# EAGLE design Mayfly_v0p5b (EAGLE 7.5.0)
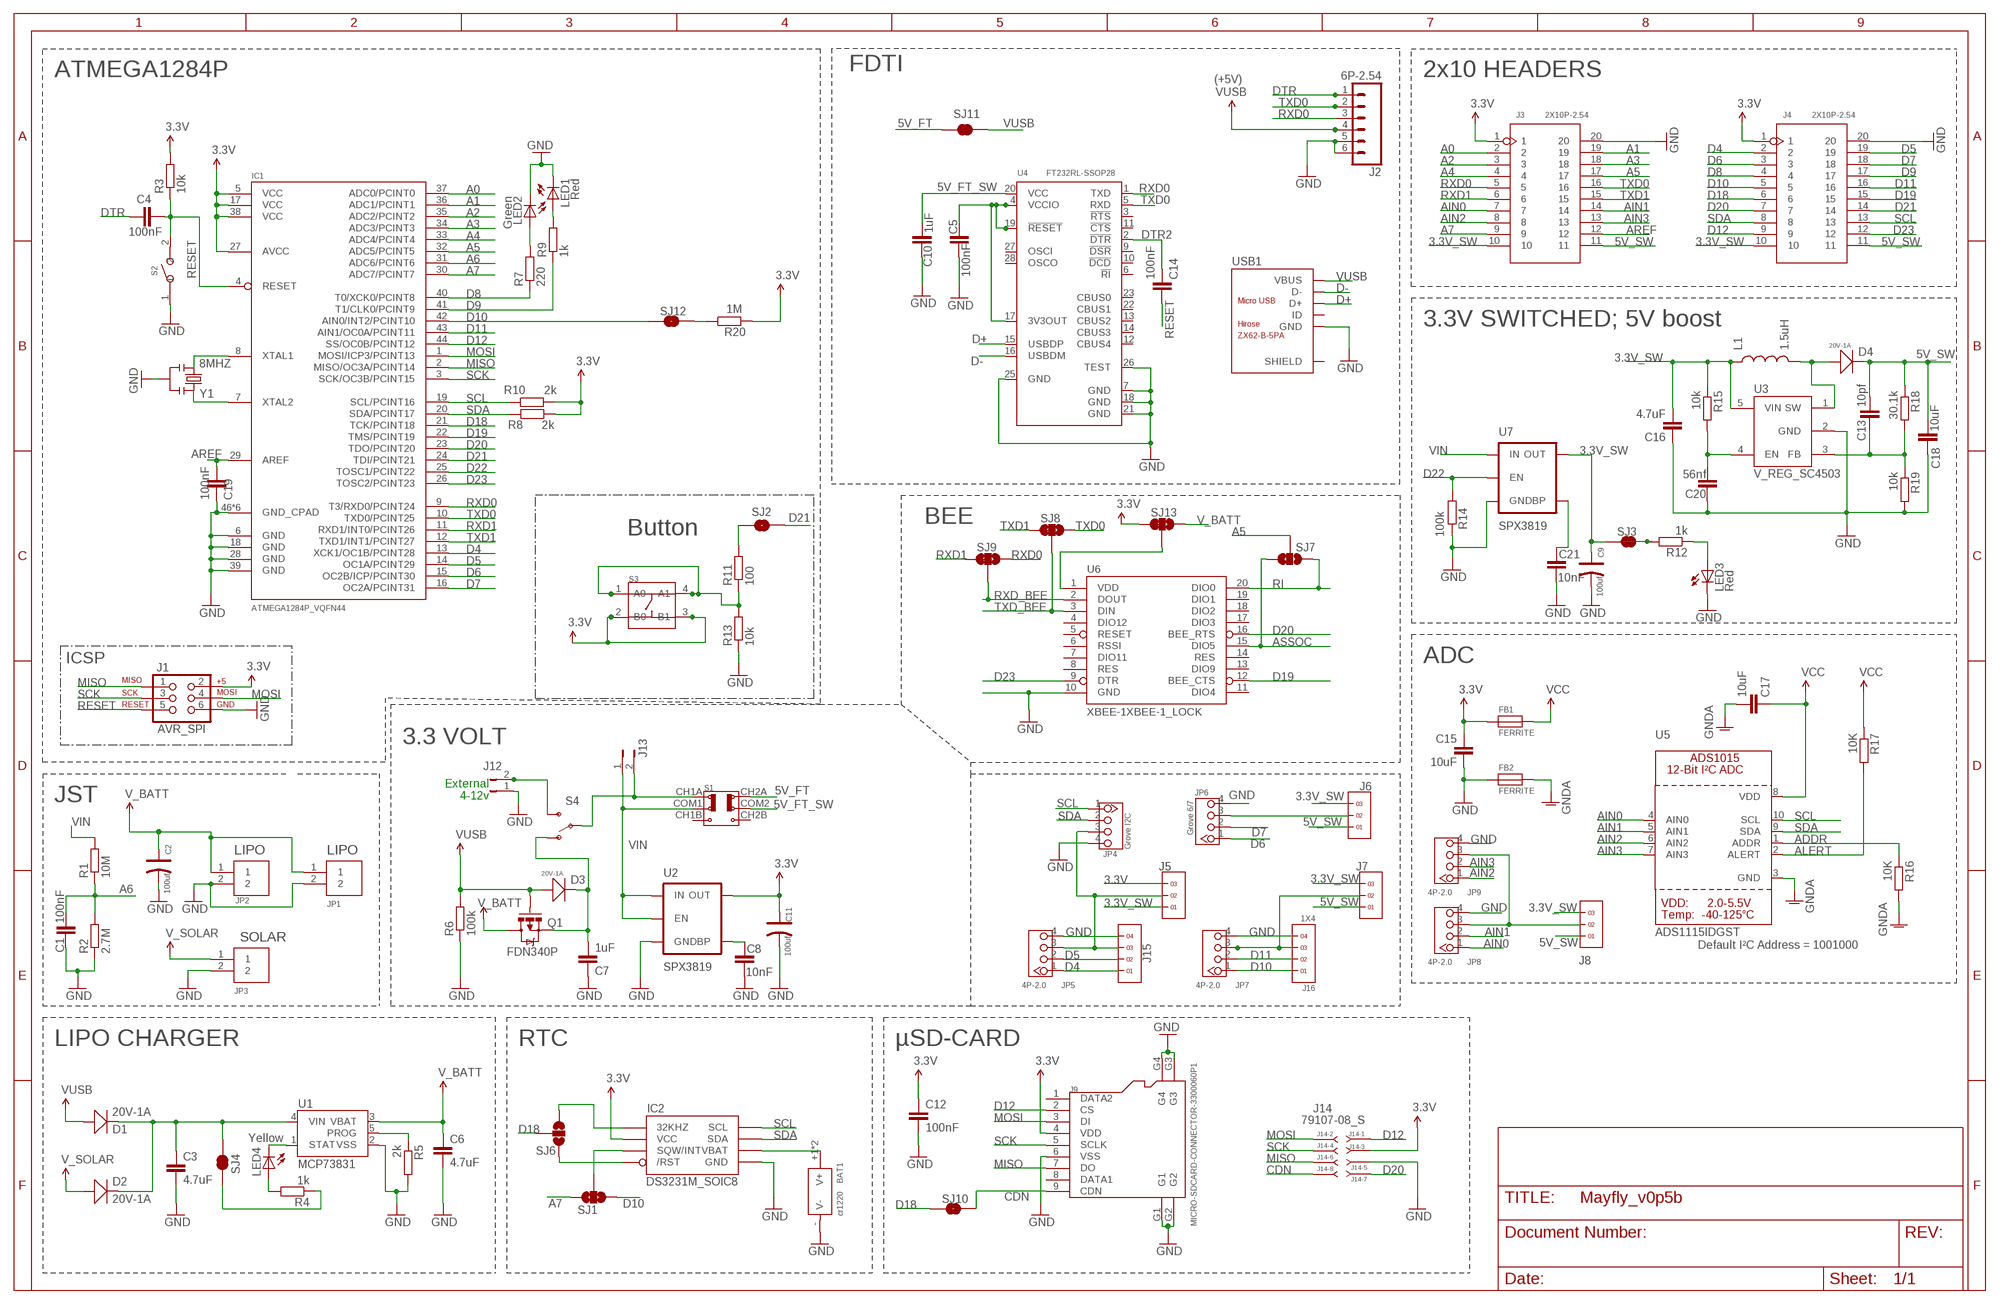
[diagram p0: schematic, sheet 1]

## Parts
BAT1  cr1220  DIP-BATTERY-CELL-HOLDER(1220)  [BAT2P-13.5-CR1220]
C1  100nF  C_0603  [C0603]
C2  100uf  TANTALUM-SMD-100UF-10V(AVX-B)  [AVX-B]
C3  4.7uF  C_0603  [C0603]
C4  100nF  C_0603  [C0603]
C5  100nF  C_0603  [C0603]
C6  4.7uF  C_0603  [C0603]
C7  1uF  C_0603  [C0603]
C8  10nF  C_0603  [C0603]
C9  100uf  TANTALUM-SMD-100UF-10V(AVX-B)  [AVX-B]
C10  1uF  C_0603  [C0603]
C11  100uf  TANTALUM-SMD-100UF-10V(AVX-B)  [AVX-B]
C12  100nF  C_0603  [C0603]
C13  10pf  CAP0603-CAP  [0603-CAP]
C14  100nF  C_0603  [C0603]
C15  10uF  C_0603  [C0603]
C16  4.7uF  CAP0805  [0805]
C17  10uF  C_0603  [C0603]
C18  10uF  CAP0805  [0805]
C19  100nF  C_0603  [C0603]
C20  56nf  CAP0603-CAP  [0603-CAP]
C21  10nF  C_0603  [C0603]
D1  20V-1A  SMD-DIODE-SCHOTTKY-20V-1A(SOD-123)  [SOD-123]
D2  20V-1A  SMD-DIODE-SCHOTTKY-20V-1A(SOD-123)  [SOD-123]
D3  20V-1A  SMD-DIODE-SCHOTTKY-20V-1A(SOD-123)  [SOD-123]
D4  20V-1A  SMD-DIODE-SCHOTTKY-20V-1A(SOD-123)  [SOD-123]
FB1  FERRITE  FERRITE0805  [0805]
FB2  FERRITE  FERRITE0805  [0805]
IC1  ATMEGA1284P_VQFN44  [VQFN44]
IC2  DS3231M_SOIC8  [SO8]
J1  AVR_SPI  AVR_SPI_PRG_6NS  [2X3-NS]
J2  6P-2.54  M06FEMALE_LOCK  [1X06_FEMALE_LOCK.010]
J3  2X10P-2.54  DIP-BLACK-FEMALE-HEADER(2X10P-2.54)-2.54  [H2X10-2.54]
J4  2X10P-2.54  DIP-BLACK-FEMALE-HEADER(2X10P-2.54)-2.54  [H2X10-2.54]
J5  1X3  [1X3]
J6  1X3  [1X3]
J7  1X3  [1X3]
J8  1X3  [1X3]
J9  MICRO-SDCARD-CONNECTOR-3300060P1  [9P-SMD-W-RING]
J12  JUMPER-PTH-2-NO  [PTH-JUMPER-2-NO_NO_SILK]
J13  JUMPER-PTH-2-NO  [PTH-JUMPER-2-NO_NO_SILK]
J14  79107-08_S  [79107-08]
J15  1X4  [1X4]
J16  1X4  [1X4]
JP1  JST_EPH_2PIN  [JST_EPH_B2B-PH-K-S]
JP2  JST_EPH_2PIN  [JST_EPH_B2B-PH-K-S]
JP3  JST_EPH_2PIN  [JST_EPH_B2B-PH-K-S]
JP4  Grove I2C  GROVE-CONNECTOR-DIP(4P-2.0)  [HW4-2.0]
JP5  4P-2.0  GROVE-CONNECTOR-DIP(4P-2.0)  [HW4-2.0]
JP6  Grove 6/7  GROVE-CONNECTOR-DIP(4P-2.0)  [HW4-2.0]
JP7  4P-2.0  GROVE-CONNECTOR-DIP(4P-2.0)  [HW4-2.0]
JP8  4P-2.0  GROVE-CONNECTOR-DIP(4P-2.0)  [HW4-2.0]
JP9  4P-2.0  GROVE-CONNECTOR-DIP(4P-2.0)  [HW4-2.0]
L1  1.5uH  INDUCTORVLF4012A  [VLF4012A]
LED1  Red  LED0603  [LED-0603]
LED2  Green  LED0603  [LED-0603]
LED3  Red  LED0603  [LED-0603]
LED4  Yellow  LED0603  [LED-0603]
Q1  FDN340P  MOSFET-P-CHANNELSMALL  [SOT23-S-PADS]
R1  10M  R_0603  [R0603]
R2  2.7M  R_0603  [R0603]
R3  10k  R_0603  [R0603]
R4  1k  R_0603  [R0603]
R5  2k  R_0603  [R0603]
R6  100k  R_0603  [R0603]
R7  220  R_0603  [R0603]
R8  2k  R_0603  [R0603]
R9  1k  R_0603  [R0603]
R10  2k  R_0603  [R0603]
R11  100  R_0603  [R0603]
R12  1k  R_0603  [R0603]
R13  10k  R_0603  [R0603]
R14  100k  R_0603  [R0603]
R15  10k  R_0603  [R0603]
R16  10K  R_0603  [R0603]
R17  10K  R_0603  [R0603]
R18  30.1k  R_0603  [R0603]
R19  10k  R_0603  [R0603]
R20  1M  R_0603  [R0603]
S1  SWITCH-2CH-6P-3010010P1  [6P-2CH-2.54-9.1X3.5X3.2+2H]
S2  SMD-BUTTON(2P-6.0X3.0X2.5MM)-DHT-1163S  [SW2-4.0-6.0X3.0X2.5MM]
S3  SMD-SWITCH-TACTILE-SPST-NO(4P-D6.0MM)  [SW4-SMD-6.0X6.0X5.0MM]
S4  SWITCH-SPDT-SMD-A  [SWITCH-SPST-SMD-A]
SJ1  SOLDERJUMPER_2WAYT  [SJ_2]
SJ2  SOLDERJUMPERNO  [SJ_2S-NO]
SJ3  SOLDERJUMPERNO  [SJ_2S-NO]
SJ4  SOLDERJUMPER_NC  [SJ_2S_NC]
SJ6  SOLDERJUMPER_2WAYT  [SJ_2]
SJ7  SOLDERJUMPER_2WAYT  [SJ_2]
SJ8  SJ_3WAY_12SHORT  [SJ_3WAY_12SHORT]
SJ9  SJ_3WAY_12SHORT  [SJ_3WAY_12SHORT]
SJ10  SOLDERJUMPERNO  [SJ_2S-NO]
SJ11  JUMPER-PAD-2-NC_BY_TRACENO_SILK  [PAD-JUMPER-2-NC_BY_TRACE_NO_SILK]
SJ12  SOLDERJUMPERNO  [SJ_2S-NO]
SJ13  SJ_3WAY_12SHORT  [SJ_3WAY_12SHORT]
U1  MCP73831  [SOT23-5]
U2  SPX3819  V_REG_LDOSMD  [SOT23-5]
U3  V_REG_SC4503  V_REG_TPS61040SMD  [SOT23-5]
U4  FT232RL-SSOP28  INTERFACE-FT232RL(SSOP28)  [SSOP28-0.65-10.2X5.2MM]
U5  ADS1115IDGST  ADC_ADS1015  [MSOP10]
U6  XBEE-1XBEE-1_LOCK  [XBEE-1_LOCK]
U7  SPX3819  V_REG_LDOSMD  [SOT23-5]
USB1  ZX62-B-5PA  MICRO-USB-SMD(ZX62-B-5PA)  [MICRO-USB5+6P-SMD-0.65-AB]
Y1  8MHZ  SMD-RESONATOR-8MHZ-33PF-0.1%(3P-3.2X1.3MM)  [X3-SMD-3.6X1.3X0.8MM]

## Nets
1.8V: D2.+ JP3.1 ; supply symbol labelled V_SOLAR
3.3V: C11.+ C12.2 C15.1 FB1.1 IC1.5(VCC) IC1.17(VCC) IC1.27(AVCC) IC1.38(VCC) IC2.2(VCC) J1.2 J3.1 J4.1 J5.3 J9.4(VDD) J14.3 R3.2 R8.1 R10.2 R20.2 S3.2(B0) S3.3(B1) SJ13.1 U2.5(OUT)
3.3V_SW: C9.+ C16.2 J3.10 J4.10 J5.1 J6.3 J7.3 J8.3 L1.P$1 R15.1 SJ3.1 U3.5(VIN) U7.5(OUT)
5V_FT: S1.CH2A SJ11.1
5V_FT_SW: C10.2 S1.COM2 U4.20(VCC)
5V_SW: C13.2 C18.1 D4.- J3.11 J4.11 J6.1 J7.1 J8.1 R18.1
A0: IC1.37(ADC0/PCINT0) J3.2
A1: IC1.36(ADC1/PCINT1) J3.19
A2: IC1.35(ADC2/PCINT2) J3.3
A3: IC1.34(ADC3/PCINT3) J3.18
A4: IC1.33(ADC4/PCINT4) J3.4
A5: IC1.32(ADC5/PCINT5) J3.17 SJ7.2
A6: C1.2 IC1.31(ADC6/PCINT6) R1.1 R2.2
A7: IC1.30(ADC7/PCINT7) J3.9 SJ1.3
ADDR: R16.1 U5.1(ADDR)
AIN0: J3.7 JP8.1 U5.4(AIN0)
AIN1: J3.14 JP8.2 U5.5(AIN1)
AIN2: J3.8 JP9.1 U5.6(AIN2)
AIN3: J3.13 JP9.2 U5.7(AIN3)
ALERT: R17.2 U5.2(ALERT)
AREF: C19.2 IC1.29(AREF) J3.12
ASSOC: SJ7.3 U6.15(DIO5)
C: IC1.8(XTAL1) Y1.1
C_N: IC1.7(XTAL2) Y1.3
CDN: J9.9(CDN) J14.8 SJ10.2
D4: IC1.13(XCK1/OC1B/PCINT28) J4.2 J15.1 JP5.1
D5: IC1.14(OC1A/PCINT29) J4.19 J15.2 JP5.2
D6: IC1.15(OC2B/ICP/PCINT30) J4.3 JP6.1
D7: IC1.16(OC2A/PCINT31) J4.18 JP6.2
D8: IC1.40(T0/XCK0/PCINT8) J4.4 R7.1
D9: IC1.41(T1/CLK0/PCINT9) J4.17 R9.1
D10: IC1.42(AIN0/INT2/PCINT10) J4.5 J16.1 JP7.1 SJ1.1 SJ12.1
D11: IC1.43(AIN1/OC0A/PCINT11) J4.16 J16.2 JP7.2
D12: IC1.44(SS/OC0B/PCINT12) J4.9 J9.2(CS) J14.1
D18: IC1.21(TCK/PCINT18) J4.6 SJ6.2 SJ10.1
D19: IC1.22(TMS/PCINT19) J4.15 U6.12(BEE_CTS)
D20: IC1.23(TDO/PCINT20) J4.7 J14.7 U6.16(BEE_RTS)
D21: IC1.24(TDI/PCINT21) J4.14 SJ2.2
D22: IC1.25(TOSC1/PCINT22) R14.2 U7.3(EN)
D23: IC1.26(TOSC2/PCINT23) J4.12 U6.9(DTR)
D+: U4.15(USBDP) USB1.3(D+)
D-: U4.16(USBDM) USB1.2(D-)
DTR: C4.1 J2.1
DTR2: C14.2 U4.2(!DTR)
GND: BAT1.-(V-) C1.1 C2.- C3.2 C5.1 C6.2 C7.1 C8.1 C9.- C10.1 C11.- C12.1 C15.2 C16.1 C18.2 C19.1 C20.1 C21.1 FB2.1 IC1.6(GND) IC1.18(GND) IC1.28(GND) IC1.39(GND) IC1.46(GND_CPAD) IC1.GND@0(GND_CPAD) IC1.GND@1(GND_CPAD) IC1.GND@2(GND_CPAD) IC1.GND@3(GND_CPAD) IC1.GND@4(GND_CPAD) IC2.5(GND) J1.6 J2.5 J2.6 J3.20 J4.20 J9.6(VSS) J9.G1 J9.G2 J9.G3 J9.G4 J12.1 J14.5 J15.4 J16.4 JP1.2 JP2.2 JP3.2 JP4.4 JP5.4 JP6.4 JP7.4 JP8.4 JP9.4 LED1.C LED2.C LED3.C R2.1 R5.2 R6.1 R13.1 R14.1 R19.2 S2.1 U1.2(VSS) U2.2(GND) U3.2(GND) U4.7(GND) U4.18(GND) U4.21(GND) U4.25(GND) U4.26(TEST) U6.10(GND) U7.2(GND) USB1.5(GND) Y1.2
GNDA: C17.2 FB2.2 R16.2 U5.3(GND)
LIPO_STAT: LED4.C U1.1(STAT)
MISO: IC1.2(MISO/OC3A/PCINT14) J1.1 J9.7(DO) J14.6
MOSI: IC1.1(MOSI/ICP3/PCINT13) J1.4 J9.3(DI) J14.2
N$1: R20.1 SJ12.2
N$2: C8.2 U2.4(BP)
N$3: R12.2 SJ3.2
N$4: LED3.A R12.1
N$5: R11.1 R13.2 S3.1(A0) S3.4(A1)
N$6: J8.2 JP8.3 JP9.3
N$7: C5.2 U4.4(VCCIO) U4.17(3V3OUT) U4.19(!RESET)
N$8: D4.+ L1.P$2 U3.1(SW)
N$9: SJ13.2 U6.1(VDD)
N$10: IC2.3(SQW/INT) SJ1.2
N$11: C7.2 D3.- Q1.2(S) S4.1(O)
N$13: LED4.A R4.2
N$14: R5.1 U1.5(PROG)
N$15: C3.1 D1.- D2.- SJ4.2 U1.4(VIN)
N$16: R4.1 SJ4.1
N$17: J5.2 J15.3 JP4.3 JP5.3
N$20: R11.2 SJ2.1
N$21: J6.2 JP6.3
N$22: J12.2 S4.3(S)
N$25: C21.2 U7.4(BP)
N$26: C13.1 R18.2 R19.1 U3.3(FB)
N$27: J7.2 J16.3 JP7.3
N$28: J13.2 S1.CH1A S4.2(P)
N$29: C20.2 R15.2 U3.4(EN)
N$38: LED1.A R9.2
N$39: BAT1.+1(V+) BAT1.+2(V+) IC2.6(VBAT)
N$40: LED2.A R7.2
RESET: C4.2 C14.1 IC1.4(RESET) J1.5 R3.1 S2.2
RI: SJ7.1 U6.20(DIO0)
RTC_32KHZ: IC2.1(32KHZ) SJ6.1
RTC_RST: IC2.4(/RST) SJ6.3
RXD0: IC1.9(T3/RXD0/PCINT24) J2.3 J3.5 SJ9.3 U4.1(TXD)
RXD1: IC1.11(RXD1/INT0/PCINT26) J3.6 SJ9.1
RXD_BEE: SJ9.2 U6.2(DOUT)
SCK: IC1.3(SCK/OC3B/PCINT15) J1.3 J9.5(SCLK) J14.4
SCL: IC1.19(SCL/PCINT16) IC2.8(SCL) J4.13 JP4.1 R10.1 U5.10(SCL)
SDA: IC1.20(SDA/PCINT17) IC2.7(SDA) J4.8 JP4.2 R8.2 U5.9(SDA)
TXD0: IC1.10(TXD0/PCINT25) J2.2 J3.16 SJ8.3 U4.5(RXD)
TXD1: IC1.12(TXD1/INT1/PCINT27) J3.15 SJ8.1
TXD_BEE: SJ8.2 U6.3(DIN)
V_BATT: C2.+ C6.1 JP1.1 JP2.1 Q1.3(D) SJ13.3 U1.3(VBAT)
VCC: C17.1 FB1.2 R17.1 U5.8(VDD)
VIN: J13.1 R1.2 S1.COM1 U2.1(IN) U2.3(EN) U7.1(IN)
VUSB: D1.+ D3.+ J2.4 Q1.1(G) R6.2 SJ11.2 USB1.1(VBUS)
Unconnected: J9.1(DATA2) J9.8(DATA1) S1.CH1B S1.CH2B U4.3(!RTS) U4.6(!RI) U4.9(!DSR) U4.10(!DCD) U4.11(!CTS) U4.12(CBUS4) U4.13(CBUS2) U4.14(CBUS3) U4.22(CBUS1) U4.23(CBUS0) U4.27(OSCI) U4.28(OSCO) U6.4(DIO12) U6.5(RESET) U6.6(RSSI) U6.7(DIO11) U6.8(RES) U6.11(DIO4) U6.13(DIO9) U6.14(RES) U6.17(DIO3) U6.18(DIO2) U6.19(DIO1) USB1.4(ID) USB1.P1(SHIELD) USB1.P2(SHIELD) USB1.P3(SHIELD) USB1.P4(SHIELD) USB1.P5(SHIELD) USB1.P6(SHIELD)

## Notes on the sheet
- FDTI | 2x10 HEADERS
- ATMEGA1284P
- (+5V)
- 3.3V SWITCHED; 5V boost
- BEE
- Button
- ADC
- ICSP
- 3.3 VOLT
- External
  4-12v
- JST
- LIPO | LIPO
- SOLAR | Default I²C Address = 1001000
- LIPO CHARGER | RTC | µSD-CARD

## Library data of the parts
BAT1 = Seeed-OPL-Connector:DIP-BATTERY-CELL-HOLDER(1220): 320170002
C1 C3-C8 C10 C12 C14 C15 C17 C19 C21 = gknff:C
C2 C9 C11 = Seeed-OPL-Capacitor:TANTALUM-SMD-100UF-10V(AVX-B): 302020015; MPN: TAJB107M010#NJ
C13 C16 C18 C20 = SparkFun-Passives:CAP: Capacitor Standard 0603 ceramic capacitor, and 0.1" leaded capacitor.
D1-D4 = Seeed-OPL-Diode:SMD-DIODE-SCHOTTKY-20V-1A(SOD-123): 304020034; MPN: B5819W
FB1 FB2 = microbuilder:FERRITE: Ferrite Bead 0603 MMZ1608B121C - 120 Ohm, 600mA Ferrite Chip - Digikey: 445-2164-1-ND BK1608HW121-T - 120 Ohm, 600mA Ferrite Chip - Digikey: 587-1876-2-ND 0805 HZ0805B272R-10 - 2.7K Ohm @ 100MHz, 200mA 0.8 Ohm DC Resistance - Digikey: 240-2504-1-ND (see also Murata BLM21BD272SN1L)
IC1 = gknff:ATMEGA1284P
IC2 = gknff:DS3231M
J1 = SparkFun-Connectors:AVR_SPI_PRG_6: AVR ISP 6 Pin This is the reduced ISP connector for AVR programming. Common on Arduino. This footprint will take up less PCB space and can be used with a 10-pin to 6-pin adapter such as SKU: BOB-08508
J2 = SparkFun-Connectors:M06: Header 6 Standard 6-pin 0.1" header. Use with straight break away headers (SKU : PRT-00116), right angle break away headers (PRT-00553), swiss pins (PRT-00743), machine pins (PRT-00117), and female headers (PRT-00115). Molex polarized connector foot print use with SKU : PRT-08094 with associated crimp pins and housings. NOTES ON THE VARIANTS LOCK and LOCK_LONGPADS... This footprint was designed to help hold the alignment of a through-hole component (i.e. 6-pin header) while soldering it into place. You may notice that each hole has been shifted either up or down by 0.005 of an inch from it's more standard position (which is a perfectly straight line). This slight alteration caused the pins (the squares in the middle) to touch the edges of the holes. Because they are alternating, it causes a "brace" to hold the component in place. 0.005 has proven to be the perfect amount of "off-center" position when using our standard breakaway headers. Although looks a little odd when you look at the bare footprint, once you have a header in there, the alteration is very hard to notice. Also,if you push a header all the way into place, it is covered up entirely on the bottom side. This idea of altering the position of holes to aid alignment will be further integrated into the Sparkfun Library for other footprints. It can help hold any component with 3 or more connection pins.
J3 J4 = Seeed-OPL-Connector:DIP-BLACK-FEMALE-HEADER(2X10P-2.54): 320030090; MPN: F185-1210A0BA1
J5-J8 = headers(2mm):1X3
J9 = OPL Eagle Library:MICRO-SDCARD-CONNECTOR: Micro SD Card
J12 J13 = SparkFun-Passives:JUMPER-PTH-2-NO
J14 = con-molex-milli-grid:79107-08_S: RECEPTACAL
J15 J16 = headers(2mm):1X4
JP1-JP3 = Daughterboard_XMEGA_A3BU_v1.0:JST_EPH_2PIN
JP4 JP6 = Seeed-OPL-Connector:GROVE-CONNECTOR-DIP(4P-2.0): 320110033; VALUE: 4P-2.0
JP5 JP7-JP9 = Seeed-OPL-Connector:GROVE-CONNECTOR-DIP(4P-2.0): 320110033
L1 = SparkFun-Passives:INDUCTOR: Inductors Basic Inductor/Choke - 0603 and 1206. Footprints are not proven and vary greatly between part numbers. INDUCTOR POWER 3.3UH 4.0A SMD 0.197" L x 0.197" W x 0.177" H (5.00mm x 5.00mm x 4.50mm)
LED1-LED4 = SparkFun-LED:LED: LEDs Standard schematic elements and footprints for 5mm, 3mm, 1206, and 0603 sized LEDs. 5mm - Spark Fun Electronics SKU : COM-00529 (and others)
Q1 = gknff:MOSFET-P-CHANNEL
R1-R20 = gknff:R
S1 = OPL:SWITCH-2CH-6P*: MS-22D18 G2 ROHS
S2 = Seeed-OPL-Switch:SMD-BUTTON(2P-6.0X3.0X2.5MM): 311020029
S3 = Seeed-OPL-Switch:SMD-SWITCH-TACTILE-SPST-NO(4P-D6.0MM): 311020004; MPN: DTSM-62K-S-V-T/R
S4 = SparkFun-Electromechanical:SWITCH-SPDT: SPDT Switch Simple slide switch, Spark Fun Electronics SKU : COM-00102 DPDT SMT slide switch, AYZ0202, SWCH-08179
SJ1 SJ6 SJ7 = SparkFun-Passives:SOLDERJUMPER_2WAY: Solder Jumper 2 way solder jumper
SJ2 SJ3 SJ10 SJ12 = SparkFun-Passives:SOLDERJUMPER: Solder Jumper Standard SMD solder jumper. Used to automate production. Two varients : Normally Open and Normally Closed are the same, but have different paste layers. NC will have a large amount of paste and should jumper during reflow.
SJ4 = gknff:SOLDERJUMPER_NC
SJ8 SJ9 SJ13 = gknff:SJ_3WAY_12SHORT
SJ11 = SparkFun-Passives:JUMPER-PAD-2-NC_BY_TRACE
U1 = SparkFun-PowerIC:MCP73831: Miniature single cell, fully integrated Li-Ion, Li-polymer charge management controller http://ww1.microchip.com/downloads/en/DeviceDoc/20001984g.pdf IC-09995; PROD_ID: IC-09995
U2 U7 = SparkFun-PowerIC:V_REG_LDO: Voltage Regulator LDO Standard 150mA LDO voltage regulator in SOT-23 layout. Micrel part MIC5205. BP (by-pass) pin is used to lower output noise with 470pF cap.
U3 = SparkFun-PowerIC:V_REG_TPS61040
U4 = Seeed-OPL-ic:INTERFACE-FT232RL(SSOP28): 310070022; MPN: FT232RL
U5 = microbuilder:ADC_ADS1015: ADS1015 - 12-bit 4-Channel I2C ADC with Internal PGA VDD: 2.0-5.5V Sampling Rate: 3.3ksps Gain Settings: 2/3, 1, 2, 4, 8, 16 I2C Address: ADDR low = 1001000x, ADDR high = 1001001x Internal Comparator The ADS1015 includes an internal comparator that can be set to output a high-level on ALERT when the conversion results exceeeds a pre-defined upper level, and will deassert itself when the level falls below a pre-defined lower threshold level. It can also be set to windowed mode where the ALERT pin will be asserted if the data exceeds the upper threshold or falls below the lower threshold.
U6 = SparkFun-RF:XBEE-1: Xbee module footprints SMT header is CONN-09042.
USB1 = Seeed-OPL-Connector:MICRO-USB-SMD(ZX62-B-5PA): 320010005; MPN: ZX62-B-5PA
Y1 = Seeed-OPL-crystal-osctllator:SMD-RESONATOR-8MHZ-33PF-0.1%(3P-3.2X1.3MM): 306030005; MPN: CSTCE8M00G15L99-R0

## Board
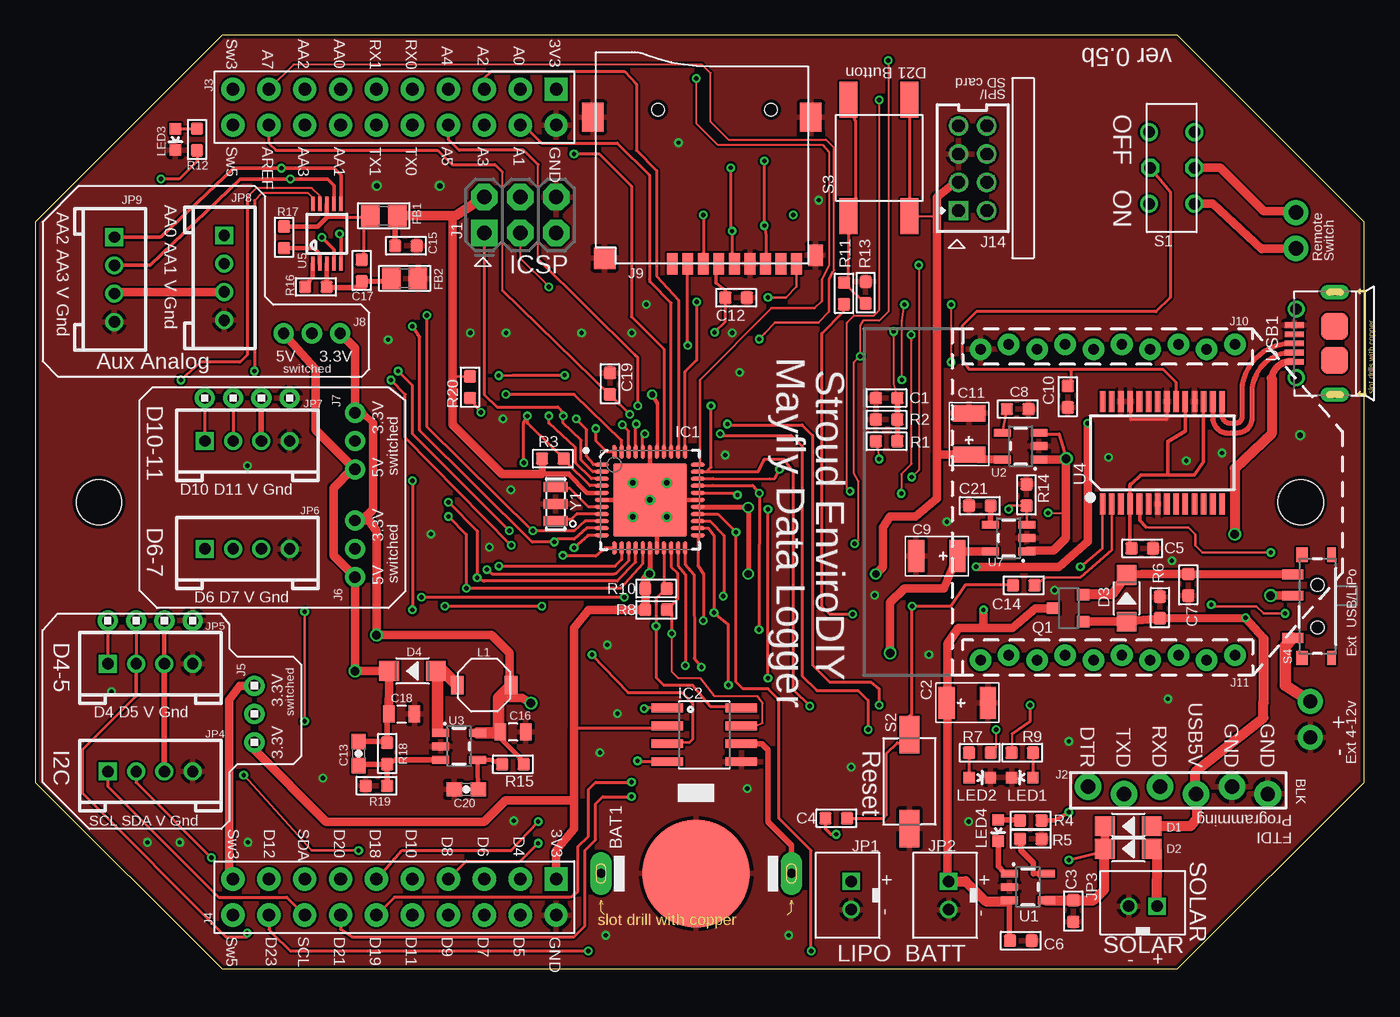
[diagram p1: board, top side]
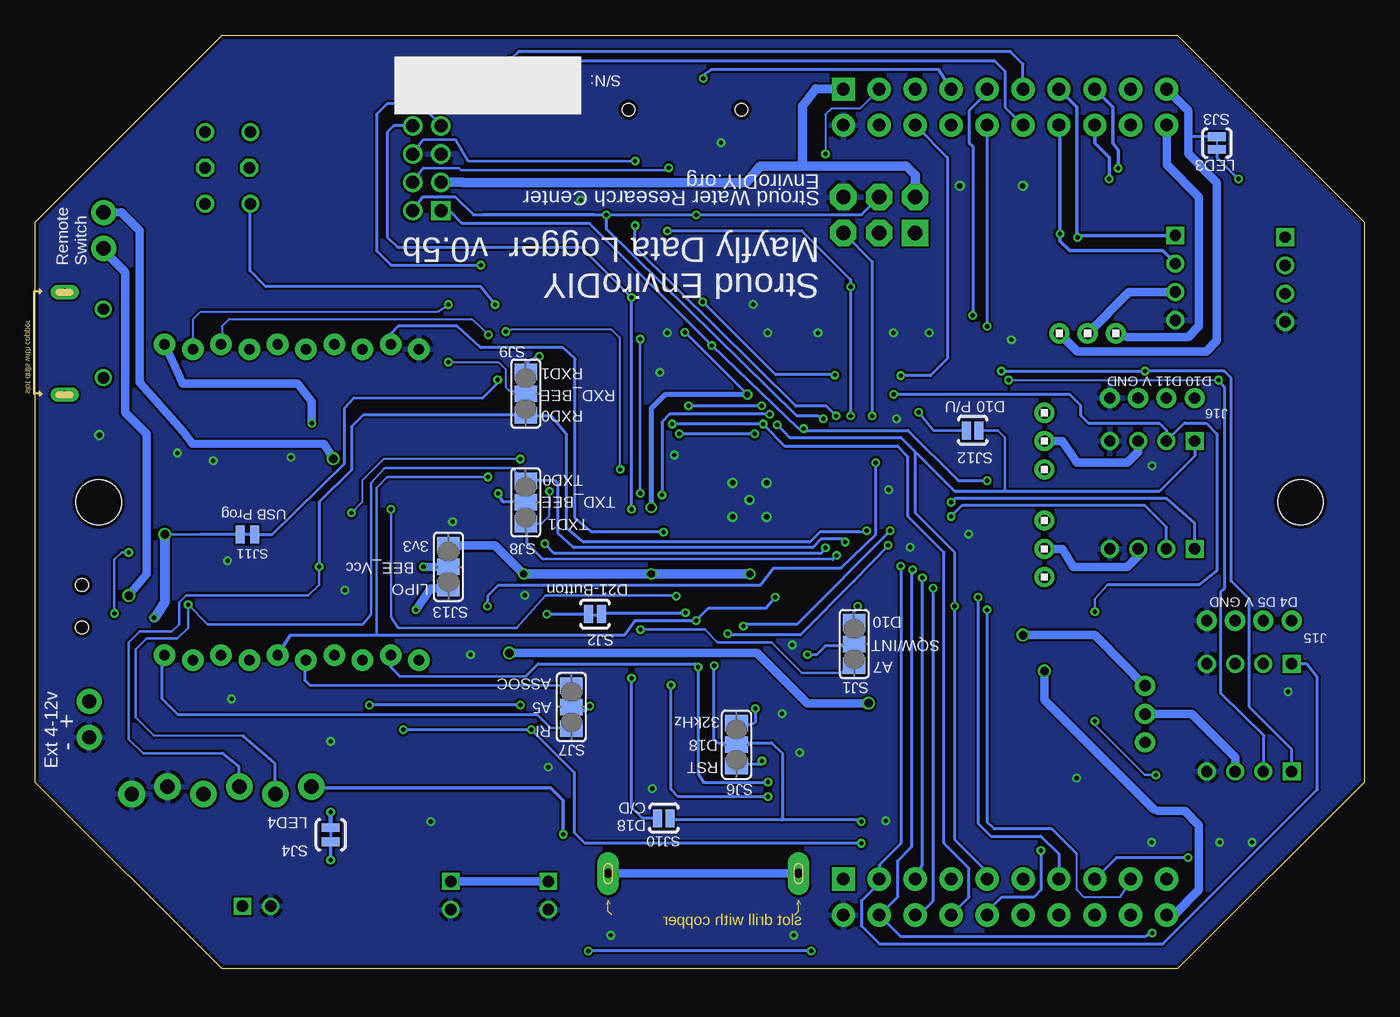
[diagram p2: board, bottom side, seen from below]

Size 93.98 x 66.04 mm. Coordinates in mm from the lower left corner, seen from the top.
Outline: 0,52.83 0,13.21 13.21,0 80.77,0 93.98,13.21 93.98,52.83 80.77,66.04 13.21,66.04 0,52.83
Copper layers (1*2*15*16): Top 0.035mm / dielectric 0.2mm / Route2 0.0175mm / dielectric 1.1mm / Route15 0.0175mm / dielectric 0.2mm / Bottom 0.035mm
Design rules "DEEGOU-DRU": minimum track width 6mil, minimum drill 12mil, track to track 6mil, track to pad 6mil, pad to pad 6mil, via to via 6mil, smd to smd 0mil, copper to edge 10mil, drill to drill 10mil, minimum pad ring 6mil, minimum via ring 6mil, stop-mask expansion 2mil, vias tented up to drill 25mil, thermal gap 10mil
Holes 3.2 mm at 89.5,33.02 4.5,33.02

### Footprints (pad centres in the part's own frame; a part is rotated, then mirrored left to right if it is on the bottom)
BAT2P-13.5-CR1220 = drill 0.635 pad 1.524 long: +1 6.731,0; +2 -6.731,0 | smd 7.62 x 7.62: - 0,0
C0603 = smd 0.889 x 0.889: 1 -0.762,0; 2 0.762,0
AVX-B = smd 1.143 x 2.286: + -1.46,0; - 1.46,0
0603-CAP = smd 1.1 x 1: 1 -0.85,0; 2 0.85,0
0805 = smd 0.8 x 1.2: 1 -0.9,0; 2 0.9,0
SOD-123 = smd 1.397 x 1.397: + -1.651,0; - 1.651,0
0805' = smd 1.3 x 1.5: 1 -0.95,0; 2 0.95,0
VQFN44 = smd 1 x 0.3: 1 -3.4,2.5; 2 -3.4,2; 3 -3.4,1.5; 4 -3.4,1; 5 -3.4,0.5; 6 -3.4,0; 7 -3.4,-0.5; 8 -3.4,-1; 9 -3.4,-1.5; 10 -3.4,-2; 11 -3.4,-2.5; 23 3.4,-2.5; 24 3.4,-2; 25 3.4,-1.5; 26 3.4,-1; 27 3.4,-0.5; 28 3.4,0; 29 3.4,0.5; 30 3.4,1; 31 3.4,1.5; 32 3.4,2; 33 3.4,2.5 | smd 0.3 x 1: 12 -2.5,-3.4; 13 -2,-3.4; 14 -1.5,-3.4; 15 -1,-3.4; 16 -0.5,-3.4; 17 0,-3.4; 18 0.5,-3.4; 19 1,-3.4; 20 1.5,-3.4; 21 2,-3.4; 22 2.5,-3.4; 34 2.5,3.4; 35 2,3.4; 36 1.5,3.4; 37 1,3.4; 38 0.5,3.4; 39 0,3.4; 40 -0.5,3.4; 41 -1,3.4; 42 -1.5,3.4; 43 -2,3.4; 44 -2.5,3.4 | smd 5.2 x 5.2: 46 0,0 | drill 0.4: GND@0 -1.2,1.2; GND@1 1.2,1.2; GND@2 -1.2,-1.2; GND@3 1.2,-1.2; GND@4 0,0
SO8 = smd 0.61 x 2.21: 1 -1.845,-2.946; 2 -0.575,-2.946; 3 0.695,-2.946; 4 1.965,-2.946; 5 1.965,2.286; 6 0.695,2.286; 7 -0.575,2.286; 8 -1.845,2.286
2X3-NS = drill 1.016 pad 1.88 square: 1 -2.54,-1.27 | drill 1.016 pad 1.88 octagon: 2 -2.54,1.27; 3 0,-1.27; 4 0,1.27; 5 2.54,-1.27; 6 2.54,1.27
1X06_FEMALE_LOCK.010 = drill 1.016 pad 1.88: 1 0,0.254; 2 2.54,-0.254; 3 5.08,0.254; 4 7.62,-0.254; 5 10.16,0.254; 6 12.7,-0.254
H2X10-2.54 = drill 0.889 pad 1.651 square: 1 -1.27,11.43 | drill 0.889 pad 1.651: 2 -1.27,8.89; 3 -1.27,6.35; 4 -1.27,3.81; 5 -1.27,1.27; 6 -1.27,-1.27; 7 -1.27,-3.81; 8 -1.27,-6.35; 9 -1.27,-8.89; 10 -1.27,-11.43; 11 1.27,-11.43; 12 1.27,-8.89; 13 1.27,-6.35; 14 1.27,-3.81; 15 1.27,-1.27; 16 1.27,1.27; 17 1.27,3.81; 18 1.27,6.35; 19 1.27,8.89; 20 1.27,11.43
1X3 = drill 0.8 pad 1.422: 1 -2,0; 2 0,0; 3 2,0
9P-SMD-W-RING = smd 1.524 x 0.762: 1 -7.493,2.114; 2 -7.493,1.014; 3 -7.493,-0.086; 4 -7.493,-1.186; 5 -7.493,-2.286; 6 -7.493,-3.386; 7 -7.493,-4.486; 8 -7.493,-5.586; 9 -7.493,-6.686 | smd 1.524 x 1.016: G1 -6.893,-8.032 | smd 2.032 x 1.524: G2 2.88,-7.686; G3 2.88,7.714 | smd 1.524 x 1.524: G4 -7.101,6.895 | hole 0.889: 3.407,-4.886; 3.407,3.114
PTH-JUMPER-2-NO_NO_SILK = drill 1.016 pad 1.778: 1 -1.27,0; 2 1.27,0
79107-08 = drill 0.914 square: 1 -3,1 | drill 0.914: 2 -3,-1; 3 -1,1; 4 -1,-1; 5 1,1; 6 1,-1; 7 3,1; 8 3,-1
1X4 = drill 0.8 pad 1.422: 1 -3,0; 2 -1,0; 3 1,0; 4 3,0
JST_EPH_B2B-PH-K-S = drill 0.813 square: 1 2,0 | drill 0.813: 2 0,0
HW4-2.0 = drill 0.8 pad 1.27 square: 1 -3,0 | drill 0.8 pad 1.27: 2 -1,0; 3 1,0; 4 3,0
VLF4012A = smd 0.9 x 1.3: P$1 -1.9,0; P$2 1.9,0
LED-0603 = smd 0.8 x 0.8: A 0,-0.75; C 0,0.75
SOT23-S-PADS = smd 0.8 x 0.9: 1 -0.95,-1; 2 0.95,-1; 3 0,1.1
R0603 = smd 0.889 x 0.889: 1 -0.762,0; 2 0.762,0
6P-2CH-2.54-9.1X3.5X3.2+2H = drill 0.813 pad 1.27: CH1A -2.54,-1.6; CH1B 2.54,-1.6; CH2A -2.54,1.6; CH2B 2.54,1.6 | drill 0.813 pad 1.27 octagon: COM1 0,-1.6; COM2 0,1.524
SW2-4.0-6.0X3.0X2.5MM = smd 2.65 x 1.4: 1 -3.325,0; 2 3.325,0
SW4-SMD-6.0X6.0X5.0MM = smd 2.54 x 1.27: 1 -4.129,2.159; 2 -4.129,-2.159; 3 4.129,-2.159; 4 4.129,2.159
SWITCH-SPST-SMD-A = smd 0.7 x 1.5: 1 -2.25,-1.75; 2 -0.75,-1.75; 3 2.25,-1.75 | smd 1 x 0.6: GND1 -3.65,1; GND3 3.65,1 | smd 1 x 0.8: GND2 -3.65,-1.1; GND4 3.65,-1.1 | hole 0.9: -1.5,0; 1.5,0
SJ_2 = smd 1.168 x 1.6: 1 -1.524,0; 2 0,0; 3 1.524,0
SJ_2S-NO = smd 0.635 x 1.27: 1 -0.45,0; 2 0.45,0
SJ_2S_NC = smd 0.635 x 1.27: 1 -0.508,0; 2 0.508,0
SJ_3WAY_12SHORT = smd 1.168 x 1.6: 1 -1.524,0; 2 0,0; 3 1.524,0
PAD-JUMPER-2-NC_BY_TRACE_NO_SILK = smd 0.635 x 1.27: 1 -0.508,0; 2 0.508,0
SOT23-5 = smd 0.55 x 1.2: 1 -0.95,-1.3; 2 0,-1.3; 3 0.95,-1.3; 4 0.95,1.3; 5 -0.95,1.3
SSOP28-0.65-10.2X5.2MM = smd 0.4 x 1.5: 1 -4.225,-3.625; 2 -3.575,-3.625; 3 -2.925,-3.625; 4 -2.275,-3.625; 5 -1.625,-3.625; 6 -0.975,-3.625; 7 -0.325,-3.625; 8 0.325,-3.625; 9 0.975,-3.625; 10 1.625,-3.625; 11 2.275,-3.625; 12 2.925,-3.625; 13 3.575,-3.625; 14 4.225,-3.625; 15 4.225,3.625; 16 3.575,3.625; 17 2.925,3.625; 18 2.275,3.625; 19 1.625,3.625; 20 0.975,3.625; 21 0.325,3.625; 22 -0.325,3.625; 23 -0.975,3.625; 24 -1.625,3.625; 25 -2.275,3.625; 26 -2.925,3.625; 27 -3.575,3.625; 28 -4.225,3.625
MSOP10 = smd 0.25 x 1: 1 -1,-2.113; 2 -0.5,-2.113; 3 0,-2.113; 4 0.5,-2.113; 5 1,-2.113; 6 1,2.113; 7 0.5,2.113; 8 0,2.113; 9 -0.5,2.113; 10 -1,2.113
XBEE-1_LOCK = drill 0.737 pad 1.524: 1 -11.178,20; 2 -10.822,18; 3 -11.178,16; 4 -10.822,14; 5 -11.178,12; 6 -10.822,10; 7 -11.178,8; 8 -10.822,6; 9 -11.178,4; 10 -10.822,2; 11 11.178,2; 12 10.822,4; 13 11.178,6; 14 10.822,8; 15 11.178,10; 16 10.822,12; 17 11.178,14; 18 10.822,16; 19 11.178,18; 20 10.822,20
MICRO-USB5+6P-SMD-0.65-AB = smd 0.4 x 1.35: 1 -1.3,2.875; 2 -0.65,2.875; 3 0,2.875; 4 0.65,2.875; 5 1.3,2.875 | smd 1.9 x 1.9: P1 -1.2,0; P2 1.2,0 | drill 0.508 pad 1.016 long: P3 -3.625,0; P4 3.625,0 | drill 0.8: P5 -2.425,2.73; P6 2.425,2.73
X3-SMD-3.6X1.3X0.8MM = smd 0.7 x 1.7: 1 -1.2,0; 2 0,0; 3 1.2,0

### Placement (x,y rotation side)
BAT1  46.73,6.75 0 top
C1  60.2,40.39 0 top
C2  65.92,18.83 0 top
C3  73.4,4.1 270 top
C4  56.64,10.67 0 top
C5  78.29,29.75 180 top
C6  69.7,2 0 top
C7  81.53,27.18 90 top
C8  69.48,39.61 180 top
C9  63.75,29.21 180 top
C10  73.01,40.48 90 top
C11  66.04,37.85 90 top
C12  49.56,47.49 180 top
C13  22.86,15.24 90 top
C14  69.9,27.14 0 top
C15  26.22,51.15 0 top
C16  33.78,16.76 180 top
C17  23.09,49.4 270 top
C18  25.91,18.03 0 top
C19  40.64,41.4 270 top
C20  30.48,12.7 0 top
C21  66.8,32.77 0 top
D1  77.3,10.1 180 top
D2  77.3,8.5 180 top
D3  77.18,26.22 90 top
D4  26.67,21.08 180 top
FB1  FERRITE  [0805']  24.64,53.27 180 top
FB2  FERRITE  [0805']  26.12,48.85 180 top
IC1  43.46,33.18 0 top
IC2  47.65,16.62 270 top
J1  34.29,53.34 0 top
J2  74.47,12.63 0 top
J3  25.4,60.96 270 top
J4  25.4,5.08 270 top
J5  15.49,18.03 270 top
J6  22.61,29.72 90 bottom
J7  22.61,37.34 90 bottom
J8  19.56,44.96 180 bottom
J9  47.15,57.37 90 top
J12  90.17,17.65 90 top
J13  89.15,52.24 270 top
J14  66.29,56.64 90 top
J15  8.13,24.64 0 top
J16  14.99,40.39 0 top
JP1  57.7,4.2 90 top
JP2  64.6,4.2 90 top
JP3  77.33,4.44 0 top
JP4  8.13,13.97 0 top
JP5  8.13,21.59 0 top
JP6  14.99,29.72 0 top
JP7  14.99,37.34 0 top
JP8  13.36,48.89 270 top
JP9  5.59,48.77 270 top
L1  31.75,20.07 180 top
LED1  69.8,13.54 90 top
LED2  66.8,13.54 270 top
LED3  9.91,58.67 180 top
LED4  68.1,9.8 180 top
Q1  73.09,25.52 90 top
R1  60.2,37.34 180 top
R2  60.2,38.86 0 top
R3  36.6,36.1 180 top
R4  70.4,10.5 180 top
R5  70.4,9.2 0 top
R6  79.53,25.57 270 top
R7  66.8,15.3 180 top
R8  43.9,25.4 0 top
R9  69.8,15.3 0 top
R10  43.9,26.9 180 top
R11  57.2,47.79 270 top
R12  11.43,58.67 270 top
R13  58.73,47.84 270 top
R14  70.1,33.53 270 top
R15  33.78,14.48 180 top
R16  19.84,48.25 0 top
R17  17.59,51.75 270 top
R18  24.89,15.24 270 top
R19  24.13,12.95 180 top
R20  30.73,41.15 90 top
S1  80.37,56.67 90 top
S2  61.82,13.27 90 top
S3  59.67,57.37 90 top
S4  90.68,25.65 270 top
SJ1  36.07,22.99 270 bottom
SJ2  54.4,25.1 0 bottom
SJ3  10.41,58.42 270 bottom
SJ4  73.1,9.49 270 bottom
SJ6  44.39,15.87 270 bottom
SJ7  56.07,18.52 90 bottom
SJ8  59.3,33 90 bottom
SJ9  59.3,40.7 270 bottom
SJ10  49.53,10.67 180 bottom
SJ11  78.99,30.73 180 bottom
SJ12  27.69,38.1 180 bottom
SJ13  64.77,28.45 270 bottom
U1  70.2,5.8 270 top
U2  69.69,36.98 90 top
U3  29.97,15.75 270 top
U4  79.7,36.52 0 top
U5  20.62,52 0 top
U6  64.84,33.02 270 top
U7  68.83,30.48 90 top
USB1  91.9,44.25 90 top
Y1  36.8,32.9 90 top

### Tracks (layer width: path | path; a pad name or v marks a point on that pad's centre or on a via)
1.8V
  Top 0.5: 79.34,8.36 D2.+
  Top 0.7: JP3.1 79.34,8.36
3.3V  (via drill 0.3, 0.41, 0.5)
  Top 0.152: IC1.38 44.02,36.38 | 43.99,16.97 IC2.2 | S3.2 63.65,53.24 63.75,54.61
  Top 0.178: R20.2 29.51,41.91
  Top 0.203: R10.2 43.14,27.25 | v48.04,45.04 48.77,45.77 48.77,47.24 48.8,47.97 48.13,48.51 | 43.99,16.97 43.89,17.22 43.89,17.07 43.94,17.02 38.1,17.02 | S3.3 S3.2
  Top 0.254: 44.02,36.38 44,40 v43.63,40.63 | C12.2 48.8,47.97 | 48.13,48.51 48.13,50.18 J9.4
  Top 0.305: IC1.5 39.02,33.68 37.7,35 | 35.84,35.04 35.8,35
  Top 0.35: IC1.17 43.46,28.36 | IC1.27 50.34,32.68 v50.42,32.64 v50.42,27.94
  Top 0.406: 37.7,35 35.8,35 | 43.46,28.36 v43.43,27.94 | FB1.1 25.44,53.21 C15.1
  Top 0.508: R3.2 35.84,35.04
  Top 0.61: R10.2 R8.1 39.12,25.4 38.1,24.13 38.1,17.02 38.1,11.94 | 35.8,35 33.02,35 29.51,38.51 29.51,41.91 29.51,53.27 | J4.1 36.83,8.38 38.1,9.91 38.1,11.94 | J14.3 65.02,55.63 63.75,54.61 63.75,36.39 | 63.75,36.39 C11.+ 66.7,36.07 U2.5 | v59.44,27.94 59.94,28.45 59.94,31.24 60.45,32 62.23,32 63.75,33.27 63.75,36.39 | J5.3 15.49,15.49 20.57,10.41 31.75,10.41 33.27,11.94 38.1,11.94
  Top 0.66: 43.14,27.25 43.14,27.58 v43.43,27.94 | FB1.1 29.51,53.27 29.73,53.27 J1.2
  Bottom 0.203: v48.04,45.04 v43.63,40.63
  Bottom 0.35: v43.63,40.63 49.44,40.63 50.42,39.64 v50.42,32.64
  Bottom 0.61: 63.77,55.64 63.75,55.63 | SJ13.1 61.47,29.97 v59.44,27.94
  Bottom 0.66: 63.75,55.63 43.69,55.63 42.73,56.77 39.73,56.77 | 39.73,56.77 32.39,56.77 31.75,56.13 J1.2 | J3.1 38.77,62.25 39.73,61.04 39.73,56.77 | v59.44,27.94 v50.42,27.94 v43.43,27.94 | J14.3 63.77,55.64
3.3V_SW  (via drill 0.6)
  Top 0.305: R15.1 34.8,14.41 32.51,16.7
  Top 0.508: 23.11,39.37 23.88,38.61 | J6.3 23.08,31.72
  Top 0.61: 23.08,31.72 23.88,32.51 23.88,38.61 | 23.11,39.37 J7.3 22.61,43.91 J8.3 | J5.1 14.45,20.03 13.72,19.05 13.72,6.86 J4.10 | J6.3 23.59,31.72 24.13,30.99 v24.13,23.62 32.26,23.62 33.53,22.35 33.53,20.19 L1.P$1 | U7.5 65.75,29.53 C9.+ 64.26,26.92 61.47,26.92 60.45,25.91 v60.45,22.35 | 32.77,19.18 34.41,19.18 v35.05,18.8
  Top 0.813: U3.5 32.51,16.7 32.88,16.7 C16.2 32.77,16.76 32.77,19.18 L1.P$1
  Bottom 0.203: SJ3.1 12.39,58.87 12.45,58.93
  Bottom 0.61: J8.3 20.29,43.69 11.18,43.69 10.41,44.45 10.41,55.63 12.45,57.66 12.45,58.93 12.45,60.71 J3.10 | v60.45,22.35 42.93,22.35 39.37,18.8 v35.05,18.8 | J5.1 18.8,23.37 19.05,23.62 v24.13,23.62
5V_FT  (via drill 0.3)
  Top 0.152: v61.29,41.68 61.29,45.84 v61.47,46.99
  Bottom 0.203: v61.29,41.68 61.32,41.42 62.36,40.39 71.44,40.41 72.12,39.67 72.12,35.77 77.22,30.73 SJ11.1 | v61.47,46.99 62.48,48.26 77.68,48.26 78.8,49.38 78.8,54.22 78.76,54.27 S1.CH2A
5V_FT_SW
  Top 0.203: S1.COM2 80.26,54.99 80.26,47.5 79.25,46.48 66.55,46.48 65.53,45.47 65.53,43.18 66.04,42.42 73.28,42.42 | C10.2 73.27,41.39 73.28,41.53 73.28,42.42 | 73.28,42.42 79.76,42.42 80.67,41.5 U4.20
5V_SW  (via drill 0.6)
  Top 0.406: C13.2 24.3,16.09 R18.1 24.89,18.92 D4.-
  Top 0.508: 22.38,35.34 J7.1
  Top 0.61: J8.1 19.81,42.45 19.81,38.13 J7.1 | 22.38,35.34 21.08,34.04 21.08,29.24 J6.1 v22.61,21.08 D4.- 25.02,18.81 C18.1
  Bottom 0.508: J4.11 13.46,3.81
  Bottom 0.61: 13.46,3.81 11.68,5.59 11.68,10.16 12.7,11.18 14.61,11.18 14.86,11.3 22.61,19.05 v22.61,21.08 | J3.11 13.97,56.9 11.68,54.61 11.68,45.47 12.45,44.7 16.76,44.7 17.53,44.96 J8.1
A0  (via drill 0.3)
  Top 0.203: v38.1,57.66 39.88,57.66 40.64,56.9 42.16,55.37 42.16,46.13 44.45,43.85 IC1.37
  Bottom 0.152: v38.1,57.66 38.1,60.45 37.69,60.87 35.66,60.87 J3.2
A1
  Top 0.203: J3.19 34.54,59.69 35.81,58.42 41.15,58.42 43.43,56.13 43.43,48.77 43.47,48.61 44.96,47.12 IC1.36
A2
  Top 0.203: J3.3 31.75,62.99 32.26,63.5 41.66,63.5 42.51,62.58 42.51,57.91 43.94,56.48 43.94,49.02 45.5,47.31 45.5,36.62 IC1.35
A3  (via drill 0.3)
  Top 0.203: v46.77,47.18 46.77,43.05 45.96,42.24 IC1.34 | v32.77,41.97 33.75,42.01 v37.43,42.01
  Bottom 0.203: v32.77,41.97 30.67,41.97 29.46,43.18 29.46,57.4 J3.18 | v37.43,42.01 37.59,42.04 41.62,42.04 v46.77,47.18
A4  (via drill 0.3)
  Top 0.152: 55.63,48.77 56.13,49.78 56.13,57.78 55.66,58.29 48.26,58.29 46.74,59.82 v46.74,62.99 | 46.99,35.81 IC1.33
  Top 0.178: 55.63,48.77 55.63,47.24 55.12,46.74 52.07,46.74 46.99,41.66 46.99,35.81
  Bottom 0.203: v46.74,62.99 46.74,63.25 46.2,63.59 30.07,63.59 J3.4
A5  (via drill 0.3)
  Top 0.152: 35.56,50.2 35.56,56.9 | v47.78,39.85 47.8,39.85
  Top 0.203: IC1.32 47.48,35.18 | 47.48,35.18 47.8,35.5 47.8,39.85 47.8,39.88 | 47.48,35.18 51.13,35.18 51.56,36.07 52.96,36.07 53.59,35.18 53.59,19.78 v54.77,18.6 | J3.17 29.21,58.64 29.97,57.91 34.54,57.91 35.56,56.9 | v42.61,39.85 42.61,43.24 42.42,43.43 35.56,50.2
  Bottom 0.203: v47.78,39.85 v42.61,39.85
  Bottom 0.254: SJ7.2 55.88,18.29 55.03,18.29 54.98,18.35 v54.77,18.6
A6  (via drill 0.3)
  Top 0.152: C1.2 60.71,41.4 v60.71,45.09
  Top 0.203: IC1.31 47.58,34.68 47.95,34.7 51.94,34.67 52.3,34.7 v52.62,35.34
  Top 0.406: R1.1 R2.2 C1.2
  Bottom 0.152: v52.62,35.34 52.62,44.62 53.21,45.21 60.33,45.21 v60.71,45.09
A7  (via drill 0.3)
  Top 0.152: J3.9 18.26,63.98 47.15,63.98 47.75,63.37 47.75,59.94 49.02,58.67 55.91,58.67 56.48,58.1 56.48,49.44 56.39,49.28
  Top 0.178: 56.39,49.28 56.13,48.77 56.13,46.48 55.37,45.72 52.32,45.72 51.56,44.96 v51.2,44.56
  Top 0.203: 47.2,34.2 46.88,34.2 IC1.30 47.68,34.18 47.9,34.2 50.75,34.2 v51.2,33.65 51.18,26.42 v51.18,24
  Bottom 0.178: v51.2,44.56 v51.2,33.65 | v51.18,24 46.61,24 45.72,23.11 41.91,23.11 39.75,20.95 36.96,20.95
  Bottom 0.203: SJ1.3 36.96,20.95
ADDR
  Top 0.305: U5.1 19.62,48.96 R16.1
AIN0  (via drill 0.3)
  Top 0.254: U5.4 21.12,50.9 v20.26,51.75
  Bottom 0.254: JP8.1 20.13,51.89 | 20.13,51.89 v20.26,51.75 | 20.13,51.89 20.32,52.08 20.32,60.96 J3.7
AIN1  (via drill 0.3)
  Top 0.254: U5.5 21.62,51.9 v21.52,52
  Bottom 0.254: JP8.2 14.22,50.8 20.83,50.8 21.52,51.49 v21.52,52 21.52,59.62 J3.14
AIN2  (via drill 0.3)
  Top 0.254: U5.6 21.62,56.15 21.12,56.64 v17.4,56.64 14.02,56.64 8.89,51.82 8.84,51.77 JP9.1
  Bottom 0.254: J3.8 17.78,60.96 17.78,58.42 17.4,57.91 v17.4,56.64
AIN3  (via drill 0.3)
  Top 0.254: U5.7 21.12,55.42 20.66,55.88 v18.03,55.88 14.48,55.88 8.13,49.78 6.1,49.78 6.08,49.77 JP9.2
  Bottom 0.254: J3.13 19.05,58.42 18.03,57.4 v18.03,55.88
ALERT
  Top 0.305: U5.2 20.12,50.55 19.76,51 18.25,51 R17.2
AREF  (via drill 0.3)
  Top 0.152: 33.02,56.39 33.02,48.01
  Top 0.203: J3.12 16.51,58.42 17.02,57.91 28.45,57.91 29.46,56.9 32.51,56.9 33.02,56.39 | IC1.29 49.45,33.68 v49.66,33.53 | 33.02,48.01 v42.04,39.24 C19.2
  Bottom 0.203: v42.04,39.24 49.12,39.24 49.66,38.7 v49.66,33.53
ASSOC
  Bottom 0.152: U6.15 74.87,21.77 74.9,21.77
  Bottom 0.178: 74.55,20.06 56.08,20.06 SJ7.3
  Bottom 0.203: SJ7.3 55.67,20.07 55.78,20.1 55.62,20.1 55.66,20.06 | 74.9,21.77 74.9,20.41 74.55,20.06
C
  Top 0.203: IC1.8 38.28,32.18 37.9,31.8 37.3,31.8 Y1.1
C_N
  Top 0.203: IC1.7 39.12,32.68 37.8,34 37.3,34 Y1.3
CDN  (via drill 0.3)
  Top 0.178: J9.9 53.84,48.25 53.09,47.5 v51.82,47.5
  Top 0.203: v51.82,20.57 v51.82,32.51
  Bottom 0.203: SJ10.2 51.05,10.67 51.82,11.43 v51.82,20.57 | v51.82,32.51 v51.82,47.5 55.37,51.05 68.37,51.05 69.09,51.77 69.09,59.18 68.63,59.64 J14.8
D4  (via drill 0.3)
  Top 0.203: IC1.13 41.46,28.96 41,28.5 v32.78,28.5 | J15.1 JP5.1
  Bottom 0.203: JP5.1 4.06,21.59 3.3,20.63 3.3,12.7 14.22,1.78 34.29,1.78 35.56,3.05 35.56,4.83 34.29,6.1 J4.2 34.29,7.37 32.77,8.89 32.77,28.07 v32.78,28.5
D5  (via drill 0.3)
  Top 0.203: IC1.14 41.96,28.86 41.1,28 40.89,27.94 32.38,27.94 32.06,28.13 v31.94,28.25 | v14.99,2.54 14.99,2.29 13.46,2.29 3.3,12.45 3.3,15.49 7.13,19.32 | J15.2 JP5.2
  Top 0.254: JP5.2 7.13,19.32
  Bottom 0.203: v14.99,2.54 15.49,2.29 32.77,2.29 J4.19 33.02,5.08 33.02,7.62 32,8.64 32,27.94 v31.94,28.25
D6  (via drill 0.3)
  Top 0.203: v29.21,33.02 31.24,30.99 v31.24,27.69 31.75,27.43 41.15,27.43 42.45,28.77 IC1.15
  Bottom 0.203: JP6.1 11.99,31.54 13.97,33.27 28.96,33.27 v29.21,33.02 | J4.3 31.24,7.37 v31.24,27.69
D7  (via drill 0.3)
  Top 0.203: IC1.16 42.96,28.66 41.4,26.92 v30.48,26.92 30.48,30.73 v29.21,32
  Bottom 0.152: 30.48,27.18 v30.48,26.92
  Bottom 0.203: JP6.2 13.99,31.26 15.49,32.77 28.45,32.77 v29.21,32 | J4.18 31.5,3.81 30.48,4.83 v30.48,26.92
D8  (via drill 0.3)
  Top 0.152: R7.1 67.95,15.69 v67.95,16.92
  Top 0.203: IC1.40 42.96,37.96 v43.1,37.85 | v58.89,16.92 58.89,19 58.19,19.7 55.27,19.7 54.23,20.74 54.23,36.99 53.48,37.75 48.55,37.75 v48.45,37.85 | J4.4 30.48,7.62 34.29,7.62 v35.56,8.89
  Bottom 0.203: v43.1,37.85 v48.45,37.85 | v67.95,16.92 v58.89,16.92 55.88,13.91 55.88,9.65 55.12,8.89 v35.56,8.89
D9  (via drill 0.3)
  Top 0.152: R9.1 69.09,15.35 69.09,16.64
  Top 0.203: IC1.41 42.46,38.51 v42.5,38.55 | v59.69,18.67 59.69,19.81 59.1,20.29 56.18,20.29 54.98,21.49 54.98,37.75 54.23,38.49 49.15,38.49 v48.95,38.55 | 69.09,16.64 70.36,17.53 v70.36,18.67
  Bottom 0.152: 42.5,38.5 v42.5,38.55
  Bottom 0.203: v42.5,38.55 v48.95,38.55 | 42.5,38.5 41,37 32.99,37 32.26,36.21 32.26,32 29.72,29.46 29.72,8.89 27.94,7.11 27.94,5.08 J4.17 | v59.69,18.67 v70.36,18.67
D10  (via drill 0.3)
  Top 0.203: IC1.42 41.96,38.04 v41.5,38.5 | J16.1 JP7.1 | v35.81,25.65 v28.96,25.65
  Bottom 0.178: SJ12.1 25.91,38.1 25.4,37.59 25.4,33.78
  Bottom 0.203: v41.5,38.5 40.64,37.59 32.77,37.59 31.75,36.58 | J4.5 26.67,6.86 28.96,9.14 v28.96,25.65 28.96,29.46 31.75,32.26 31.75,36.58 | JP7.1 11.99,36.27 14.48,33.78 25.4,33.78 28.96,33.78 31.75,36.58 | SJ1.1 36.07,25.27 v35.81,25.65
D11  (via drill 0.3)
  Top 0.178: v19.05,25.27 v19.05,17.53 | v14.73,13.72 19.56,8.38 v22.86,8.38
  Top 0.203: IC1.43 41.46,37.39 38.1,40.64 v33.27,40.64 | J16.2 JP7.2
  Bottom 0.178: 18.16,27.18 19.05,26.16 v19.05,25.27 | v19.05,17.53 19.05,17.27 15.49,13.72 v14.73,13.72
  Bottom 0.203: v33.27,40.64 20.83,40.64 20.07,39.88 20.07,39.18 19.5,38.61 14.48,38.61 13.99,38.12 JP7.2 12.72,38.62 11.18,38.61 10.41,37.85 10.41,28.19 11.68,27.18 18.16,27.18 | v22.86,8.38 22.86,5.59 23.37,5.08 25.65,5.08 26.67,4.06 J4.16
D12  (via drill 0.3)
  Top 0.152: 46.13,50.23 J9.2
  Top 0.203: IC1.44 40.42,36.58 39.65,37.35 v39.65,38.23 | v46.13,44.1 46.13,50.23 | v26.67,34.54 v26.67,25.4
  Bottom 0.152: v39.65,38.23 39.65,38.08 39.41,38.1 | J4.9 17.27,5.08 19.81,5.08 20.32,5.59 20.32,8.13
  Bottom 0.203: v39.65,38.23 40.01,38.23 v46.13,44.1 54.77,52.74 63.79,52.74 64.69,53.64 J14.1 | v26.67,25.4 26.67,10.41 26.16,9.91 22.1,9.91 20.32,8.13 | 39.41,38.1 32.26,38.1 28.7,34.54 v26.67,34.54
D18  (via drill 0.3)
  Top 0.203: IC1.21 45.46,28.54 46,27.9 46,22.12 v45.97,21.46 | J4.6 25.91,8.38 33.66,8.38 v35.56,10.41
  Bottom 0.152: 44.49,15.97 SJ6.2
  Bottom 0.203: 44.29,15.77 SJ6.2 43.76,15.49 43.76,15.93 43.69,16 41.91,16 41.15,15.24 41.15,10.54 | 44.49,15.97 45.69,15.97 45.97,16.26 v45.97,21.46 | 41.15,10.54 35.69,10.54 v35.56,10.41 | 41.15,10.54 48.64,10.54 49.28,10.67 SJ10.1
D19  (via drill 0.3)
  Top 0.203: IC1.22 45.96,28.64 46.6,27.9 46.61,21.97 v47.11,21.35 | J4.15 25.4,5.08 37.85,5.08 38.35,5.46 38.35,8.64 39.12,9.4 39.12,12.7 39.62,13.21 v42.16,13.21
  Bottom 0.203: U6.12 68.98,22.35 68.87,22.35 68.83,22.32 68.83,21.34 68.22,20.71 59.31,20.7 58.42,21.59 47.35,21.59 v47.11,21.35 47.11,13.83 46.74,13.21 v42.16,13.21
D20  (via drill 0.3)
  Top 0.152: v62.48,49.78 62.48,35.31 v61.98,34.8
  Top 0.203: IC1.23 46.86,28.54 47.24,27.94 v47.24,24.64 | v41.66,26.29 v27.3,26.29
  Bottom 0.178: v61.98,34.8 69.09,34.8 69.85,34.04 69.85,23.62
  Bottom 0.203: U6.16 75.93,23.62 69.85,23.62 52.32,23.62 51.56,24.64 v47.24,24.64 46.35,25.53 42.29,25.53 41.78,26.16 v41.66,26.29 | v27.3,26.29 27.3,10.29 26.42,9.4 22.86,9.4 21.59,8.13 J4.7 | v62.48,49.78 68.83,49.78 69.85,50.8 69.85,60.45 69.09,61.21 66.8,61.21 66.06,60.47 J14.7
D21  (via drill 0.3)
  Top 0.152: v48.01,25.19 v48,25.2
  Top 0.203: IC1.24 47.62,31.18 48,30.65 v48,25.2 48,25.15 48,25.25 | J4.14 21.59,2.79 22.35,2.29 38.1,2.29 38.86,3.05 38.86,8.38 39.62,9.14 39.62,11.68 40.13,12.19 v42.16,12.19 | v49.02,20.07 49.02,24.38 v48.01,25.19
  Bottom 0.203: 53.9,25.2 v48,25.2 | v42.16,12.19 48.51,12.19 49.02,12.7 v49.02,20.07
  Bottom 0.254: SJ2.2 53.9,25.1 53.9,25.2
D22  (via drill 0.3)
  Top 0.152: v48.64,26.37 48.7,26.57
  Top 0.178: R14.2 U7.3 70.13,32.77 68.83,32.77 v68.83,32.51
  Top 0.203: IC1.25 47.72,31.68 48.7,30.65 48.7,26.57
  Bottom 0.178: v68.83,32.51 68.83,24.89 68.33,24.13 59.94,24.13 57.91,26.42 48.72,26.42 v48.64,26.37
D23  (via drill 0.3)
  Top 0.203: IC1.26 48.27,32.18 v49.55,30.9 49.55,20.3 50.04,19.81 51.82,19.81 52.58,19.05 52.58,10.67 54.86,8.38 v54.86,1.27 | J4.12 16.53,2.79 16.76,2.54 18.03,1.27 v39.12,1.27
  Bottom 0.203: v49.55,30.9 54.6,30.9 55.8,31.9 55.8,43.16 56.64,43.94 62.48,43.94 64.14,45.47 68.33,45.47 68.83,44.96 68.83,44.19 U6.9 | v39.12,1.27 v54.86,1.27
D+
  Top 0.35: U4.15 83.92,39.34 arc90 84.4,38.62 84.9,38.62 arc90 85.35,39.06 85.35,40.97 arc-90 88.98,44.25 USB1.3
D-
  Top 0.35: U4.16 83.28,38.84 arc90 84.55,37.92 85,37.92 arc90 86.05,38.96 86.05,40.52 arc-90 88.62,43.6 USB1.2
DTR  (via drill 0.3)
  Top 0.254: C4.1 55.88,9.91 56.26,9.53 v56.64,9.53
  Bottom 0.254: J2.1 74.74,12.89 74.93,12.83 57.53,12.83 56.64,11.94 v56.64,9.53
DTR2
  Top 0.178: U4.2 76.12,29.64 73.91,27.69 71.47,27.69 C14.2
GND  (via drill 0.3, 0.4)
  Top 0.152: 80.03,38.88 80.01,38.86 | 77.47,40.1 U4.25
  Top 0.203: U4.21 80.03,38.88 | 80.01,38.86 77.47,38.86 77.47,40.1
  Top 0.305: IC1.6 42.22,33.18 42.5,32.9 42.5,32.2 42.46,32.24 IC1.GND@0 43.46,35.18 IC1.39 | IC1.GND@3 44.46,32.24 42.5,34.2 | IC1.28 45.46,33.18 IC1.GND@3 | IC1.18 43.96,31.58 IC1.GND@3
  other vias: 75.9,36.2 80.1,19.1 66,10.43 73.1,16.1 48.79,36.35 83.94,36.49 81.4,35.95 49.3,44.99 49.81,42.19 40.44,22.92 28.6,55.4 24.15,55.4 33.63,33.89 5.39,19.62 39.93,15.3 53.29,2.38 40.33,2.38 57.71,14.29 27.96,30.76 15.01,35.59 15.04,8.95 59.35,26.44 89.45,37.76 45.49,58.45 10.21,8.95 7.93,8.95 33.3,44.99 38.63,44.99 42.19,44.99 43.2,47.02 32.11,29.83 33.84,10.48 24.95,44.51 20.34,13.49 64.47,31.63 63.2,22.23 80.38,28.87 72.09,26.8 55.39,54.38 50.35,12.76 41.17,18.06 33.07,38.93 30.76,44.99
  pour Bottom: -0.7,67.54 94.8,67.04 95.1,-0.7 -0.6,-0.6
  pour Top: -1.3,68.04 95.5,67.74 95.6,-1.2 -1.1,-1.2
GNDA
  Top 0.305: U5.3 20.62,48.04
  Top 0.406: FB2.2 24.78,48.61 C17.2 23.32,48.3 22.97,48.2 20.89,48.2 20.62,48.04 R16.2
LIPO_STAT
  Top 0.406: U1.1 68.5,6.85 68.1,7.25 LED4.C
MISO  (via drill 0.3)
  Top 0.152: 51.69,50.64 J9.7 | 37.34,39.37 v37.34,39.12
  Top 0.203: IC1.2 39.42,35.18 38.6,36 38.6,37.4 37.34,38.61 v37.34,39.12 | 51.69,50.64 51.69,51.88 v51.56,52.58 v51.56,57.15 | 37.34,39.37 36.96,39.75 32.64,39.75 31.75,40.64 J1.1
  Bottom 0.152: J14.6 67.29,57.67
  Bottom 0.178: v51.56,57.15 63.37,57.15 64.26,58.67 66.55,58.67 67.29,57.67
  Bottom 0.203: v51.56,52.58 51.56,51.05 40.2,39.81 38.04,39.81 v37.34,39.12
MOSI  (via drill 0.3)
  Top 0.152: 47.24,50.64 J9.3
  Top 0.203: IC1.1 39.47,35.68 39,36.25 39,38.15 v38.25,38.91 | v47.24,53.34 47.24,50.64
  Bottom 0.152: 40.64,53.34 35.56,53.34 35.55,53.35 | v47.24,53.34 46.99,53.35 | v53.59,53.34 v53.59,53.35
  Bottom 0.203: J1.4 35.55,53.35 46.99,53.35 v53.59,53.35 62.33,53.35 | v38.25,38.91 38.61,39.12 40.13,39.12 53.59,52.32 v53.59,53.34 | 54.45,53.34 62.33,53.35 | 62.33,53.35 63,53.35 64.26,54.61 66.58,54.61 J14.2
N$1  (via drill 0.3)
  Top 0.178: R20.1 v31.5,39.37
  Bottom 0.178: v31.5,39.37 30.48,38.1 SJ12.2
N$2
  Top 0.178: U2.4 C8.2
N$3  (via drill 0.3)
  Top 0.203: R12.2 11.43,57.15 10.16,55.88 v8.89,55.88
  Bottom 0.203: SJ3.2 10.41,57.4 v8.89,55.88
N$4
  Top 0.203: LED3.A 11.42,59.42 R12.1
N$5
  Top 0.152: 58,52.5 S3.1 57.5,52
  Top 0.203: 58,52.5 58,60 S3.4 | 57.5,52 57.45,48.44 R11.1 R13.2
N$6
  Top 0.508: JP9.3 5.71,47.89
  Top 0.61: 5.71,47.89 JP8.3
  Bottom 0.61: J8.2 16.63,47.89 JP8.3
N$7
  Top 0.254: 80.1,34.95 78.2,34.95 77.5,34.31 arc90 77.42,34.23 U4.4 77.42,30.22 C5.2 | 80.1,34.95 80.1,37.31 81.33,38.03 U4.19 | U4.17 82.6,39.21 82.6,35.85 81.95,34.95 80.1,34.95
N$8
  Top 0.406: U3.1 28.67,16.79 28.45,17.02 | 28.45,20.76 28.42,20.98
  Top 0.813: 28.42,20.98 D4.+ 28.58,21.34 L1.P$2 | 28.45,17.02 28.45,20.76
N$9  (via drill 0.3)
  Top 0.61: v74.42,38.61 74.42,30.23 72.39,28.45 v66.55,28.45
  Bottom 0.61: U6.1 83.57,41.4 75.44,41.4 74.42,40.13 v74.42,38.61 | v66.55,28.45 SJ13.2
N$10  (via drill 0.3)
  Top 0.152: 45.49,15.98 44.49,15.98 IC2.3
  Top 0.203: IC2.3 44.66,15.97 46.26,16.01 46.49,16.26 46.48,18.8 45.72,19.56 41.91,19.56 v39.37,22.23
  Bottom 0.203: SJ1.2 36.07,22.86 38.1,22.86 38.73,22.23 v39.37,22.23
N$11
  Top 0.61: D3.- 78.27,27.94 C7.2 S4.1
  Top 0.7: Q1.2 74.17,26.54 76.2,26.54 76.34,26.73 D3.-
N$13
  Top 0.406: LED4.A 69.59,10.55 R4.2
N$14
  Top 0.406: 69.6,9.16 R5.1 69.7,9.1 69.7,8.4 70.6,7.5 70.6,6.74 U1.5
N$15  (via drill 0.3)
  Top 0.203: D2.- 75.2,8.2 v73.1,7.69
  Top 0.406: 73.31,4.85 C3.1
  Top 0.61: D1.- D2.-
  Top 0.7: U1.4 73.31,4.85 | C3.1 74.86,4.86 75.6,5.6 75.6,8.45 D2.-
  Bottom 0.254: SJ4.2 v73.1,7.69
N$16  (via drill 0.3)
  Top 0.305: v73.1,11.09 72.1,10.5 R4.1
  Bottom 0.305: SJ4.1 73.11,10.85 v73.1,11.09
N$17
  Top 0.305: J15.3 JP5.3
  Top 0.406: JP5.3 JP4.3 9.14,13.97
  Bottom 0.61: J5.2 12.19,18.03 9.13,14.97 JP4.3
N$19
  Bottom 0.152: 10.41,58.93 10.41,58.17
N$20  (via drill 0.3)
  Top 0.203: R11.2 57.15,47.15 57.15,46.48 55.63,44.96 55.63,25.65 56.18,25.1 v57.81,25.1
  Bottom 0.203: v57.81,25.1 SJ2.1
N$21
  Bottom 0.61: J6.2 21.34,29.72 20.57,28.45 16.76,28.45 15.99,29.23 JP6.3
N$22
  Top 0.813: S4.3 88.39,22.86 88.39,20.07 J12.2
N$23
  Bottom 0.203: 36.07,21.59 36.07,22.86
N$24
  Bottom 0.203: 54,25 55,25
N$25
  Top 0.406: U7.4 C21.2
N$26
  Top 0.406: U3.3 25.47,14.8 R18.2 | R19.1 R18.2 | R18.2 22.95,14.48 C13.1
N$27
  Top 0.406: JP7.3 J16.3
  Bottom 0.61: J7.2 21.34,37.34 20.32,35.81 16.76,35.81 15.99,36.59 JP7.3
N$28  (via drill 0.6)
  Top 0.61: S1.CH1A 83.29,54.13 86.74,50.93 86.78,50.97 J13.2 | S4.2 v87.38,26.42
  Bottom 0.61: v87.38,26.42 86.11,27.94 86.11,37.85 87.63,39.37 87.63,49.28 89.15,50.8 J13.2
N$29
  Top 0.305: C20.2 31.27,13.77 U3.4 32.19,14.8 R15.2
N$31
  Bottom 0.406: 64.77,29.72 64.77,28.7
N$38
  Top 0.203: R9.2 70.55,15.54 LED1.A
N$39
  Top 0.152: 49.99,15.98 IC2.6
  Top 0.305: IC2.6 49.69,15.93
  Top 0.406: IC2.6 49.47,15.92 51.39,15.92 51.82,15.49 51.82,10.41 53.47,8.76 53.47,8.13 BAT1.+1
  Bottom 0.61: BAT1.+2 BAT1.+1
N$40
  Top 0.203: R7.2 66.04,13.81 LED2.A
RESET  (via drill 0.3)
  Top 0.203: 37.6,35.8 37.3,36.1 R3.1 | IC1.4 39.22,34.18 37.6,35.8 | 37.6,35.8 37.6,35.9 35.05,38.35 34.8,38.61 v34.8,39.12 34.54,38.61 v34.54,35.81 | 61.21,16.51 61.3,16.59 S2.2 | C4.2 59.94,10.67 60.2,10.92 60.2,15.24 60.96,16 61.72,16 61.82,16.1 S2.2 | C14.1 68.83,27.18 65.79,27.18 64.77,25.65 v62.01,25.65 61.98,25.65 61.98,18.03 61.72,17.78 S2.2
  Bottom 0.203: v34.54,35.81 34.54,30.73 36.99,28.35 41.78,28.35 42.7,27.18 61.21,27.18 61.98,26.42 v62.01,25.65 | J1.5 34.8,50.04 v34.8,39.12
RI
  Bottom 0.152: U6.20 85,22.02 85.02,21
  Bottom 0.203: SJ7.1 56.06,17.08 57.55,17.05 58.5,18 83.9,18 85.02,19.12 85.02,21 85.02,21.96
RTC_32KHZ  (via drill 0.3)
  Top 0.203: IC2.1 43.35,18.47 v43.05,18.42
  Bottom 0.203: v43.05,18.42 43.05,17.47 43.35,17.27 44.17,17.27 SJ6.1
RTC_RST  (via drill 0.3)
  Top 0.203: IC2.4 42.81,14.66 v42.59,14.72
  Bottom 0.203: 42.69,14.47 v42.59,14.72 42.59,14.57 42.69,14.47 | 42.69,14.47 44.17,14.47 SJ6.3
RXD0  (via drill 0.3, 0.31)
  Top 0.178: U4.1 75.47,29.75 v73.91,28.45
  Top 0.203: IC1.9 38.88,31.68 38.1,30.99 v35.18,30.99 27.69,38.35 v27.69,46.23
  Bottom 0.152: J3.5 26.67,61.98
  Bottom 0.178: v73.91,28.45 73.91,27.18 74.68,26.42 83.31,26.42 83.82,25.91 83.82,24.38 84.33,23.88 86.61,23.88 87.38,23.11 87.38,16.26 86.36,15.24 80.73,15.25
  Bottom 0.203: SJ9.3 59.67,39.18 | SJ9.3 59.22,39.1 57.5,39.1 56.4,37.8 56.4,31.2 55.2,30.2 39.2,30.2 38.5,30.9 35.67,30.9 v35.18,30.99 | J2.3 79.57,14.35 80.73,15.25 | 26.67,61.98 27.94,60.71 27.94,58.42 27.69,58.17 v27.69,46.23 | SJ9.3 70.81,39.18 71.63,38.35 71.63,35.31 73.91,33.02 v73.91,28.45
RXD1  (via drill 0.3)
  Top 0.152: v57.95,30.07 58.21,30.33 58.21,34.5 57.91,35.05 57.91,42.93 57.95,42.99 v58.33,43.34 58.33,45.51 58.55,45.85 59.69,45.85 60.33,46.48 v60.33,64.26
  Top 0.203: IC1.11 39.08,30.68 v38.1,29.8
  Bottom 0.203: v38.1,29.8 38.1,29.7 38.4,29.4 57.28,29.4 v57.95,30.07 | v58.33,43.34 59.09,43.01 59.18,42.93 59.18,42.16 59.28,42.2 SJ9.1 | J3.6 24.13,64.01 25.02,64.9 59.82,64.9 60.33,64.39 v60.33,64.26
RXD_BEE  (via drill 0.3)
  Top 0.152: v64.77,46.99 v64.77,42.93
  Bottom 0.152: U6.2 82.8,43.94 82.8,45.97 82.3,46.48 65.53,46.48 v64.77,46.99 | v64.77,42.93 61.21,42.93 60.71,42.42 60.71,41.15 60.45,40.89 59.69,40.89 59.8,40.75
  Bottom 0.203: 59.8,40.75 59.3,40.75 SJ9.2
SCK  (via drill 0.3)
  Top 0.152: 49.31,49.72 J9.5 49.21,50.64 | J1.3 34.29,50.29 v36.32,48.26
  Top 0.203: IC1.3 39.32,34.68 38.2,35.8 38.2,36.9 36.32,38.61 v36.32,39.12 | 49.31,49.72 49.31,52.16 v49.28,52.2 49.18,52.29 v49.18,56.67
  Bottom 0.178: v49.18,56.67 49.34,56.52 63.88,56.52 64.01,56.64 66.55,56.64 J14.4
  Bottom 0.203: v49.28,52.2 39.75,52.2 36.32,48.77 v36.32,48.26 v36.32,39.12
SCL  (via drill 0.3)
  Top 0.152: 49.99,18.48 IC2.8 | U5.10 19.62,54.55 19.3,54.86 16,54.86 15.49,54.36
  Top 0.203: IC1.19 44.46,27 | 44.46,26.76 43.9,26.2 v43.9,24.26 43.94,24.13 43.94,20.57 44.45,20.07 46.48,20.07 47.71,18.58 47.75,18.54 49.6,18.54 IC2.8 | JP4.1 5.13,12.91 12.95,5.08 17.78,5.08 J4.13 | 15.49,54.36 v15.49,42.29 | v33.53,30.99 26.67,37.85 26.67,41.27 v25.65,42.29
  Top 0.305: 44.46,26.76 44.46,27 R10.1
  Bottom 0.203: v25.65,42.29 v15.49,42.29 9.91,42.29 9.4,41.78 9.4,27.43 8.13,26.16 8.13,18.54 5.13,15.54 JP4.1 | v33.53,30.99 40.13,24.38 43.77,24.38 v43.9,24.26
SDA  (via drill 0.3)
  Top 0.152: 50.98,17.2 51.44,17.4 51.44,18.8 51.05,19.3 48.01,19.3 46.99,20.57 45.47,20.57 45,21.04 v45,23.71 | U5.9 20.12,54.69 19.56,55.24 15.62,55.24 14.99,54.61
  Top 0.203: IC1.20 44.96,28.44 45.4,28 45.4,26.14 R8.2 44.71,25.29 45,25.29 v45,23.71 | 50.98,17.2 IC2.7 | JP4.2 7.13,13.19 v12.45,7.87 | 14.99,54.61 14.99,43.43 14.48,42.93 11.68,42.93 v10.29,41.66 | v33.66,29.97 26.16,37.59 26.16,40.64 v25.15,41.66
  Bottom 0.152: v25.15,41.66 v10.29,41.66
  Bottom 0.203: v12.45,7.87 17.53,7.87 J4.8 | v10.29,41.66 9.91,41.15 9.91,26.92 10.16,26.67 10.16,19.54 7.11,16.51 7.13,16.27 JP4.2 | v33.66,29.97 36.07,27.43 39.88,23.62 44.96,23.62 v45,23.71
TXD0  (via drill 0.3, 0.31)
  Top 0.152: v36.7,30.19 36.67,30.16 v36.7,30.2
  Top 0.178: 78.55,31.26 78.74,31.24 81.53,31.24 82.04,30.73 82.04,29.97 82.55,29.46 v87.38,29.46 | v88.39,25.15 86.87,25.15 86.36,25.65 83.31,25.65 v83.17,25.77
  Top 0.203: IC1.10 38.98,31.18 38.1,30.4 36.9,30.4 v36.7,30.2 | v26.67,45.47 27.18,44.7 27.18,38.1 35.15,30.19 v36.7,30.19
  Top 0.254: U4.5 78.1,32.36 78.1,31.72 78.55,31.26
  Bottom 0.178: 70.87,24.38 81.78,24.38 v83.17,25.77 83.19,25.65 83.19,24.13 83.95,23.37 86.11,23.37 86.87,22.61 86.87,17.78 85.6,16.51 79.28,16.5 | 70.83,24.37 70.25,25.08 70.25,34.38 69.3,35.41 69.22,35.43 60.18,35.43 59.65,34.65 | v87.38,29.46 87.88,29.46 88.39,28.96 v88.39,25.15
  Bottom 0.203: v36.7,30.2 36.9,30.4 38.4,30.4 39,29.8 55.9,29.8 57,30.8 57,34.32 57.24,34.55 59.52,34.55 59.8,34.32 | SJ8.3 59.8,34.32 | 59.8,34.32 59.65,34.65 | J2.2 77.03,14.56 79.28,16.5 | 70.87,24.38 70.83,24.37 | J3.16 v26.67,45.47
TXD1  (via drill 0.3)
  Top 0.152: v59.69,61.47 59.69,46.61 59.31,46.23 57.91,46.23 57.4,45.72 57.4,34.04 v57.62,33.79
  Top 0.203: IC1.12 40.28,29.78 39.62,29.21 37.34,29.21 v37.3,29.25
  Bottom 0.152: v57.62,33.79 57.62,32.04 58.17,31.5 59,31.5 SJ8.1
  Bottom 0.203: v37.3,29.25 37.59,28.96 58.1,29 59.2,30.1 59.2,31.18 SJ8.1 | v59.69,61.47 59.69,63.75 59.18,64.26 26.16,64.26 25.4,63.5 25.4,60.96 J3.15
TXD_BEE  (via drill 0.3)
  Top 0.152: v61.93,44.86 61.98,44.45 61.98,35.73 61.25,35.01 v61.25,33.63
  Bottom 0.152: U6.3 80.77,44.2 80.77,45.47 80.71,45.53 80.26,45.97 63.11,45.97 v61.93,44.86
  Bottom 0.203: SJ8.2 59.94,33.02 60.89,33.02 v61.25,33.63 | U6.3
V_BATT  (via drill 0.3)
  Top 0.152: U1.3 69,5 68.85,4.8
  Top 0.406: C6.1 68.9,2.54 U1.3
  Top 0.6: 64.63,6.21 JP2.1
  Top 0.61: 67.06,24.13 65.28,24.13 64.5,23 64.5,18.87 C2.+ | 67.06,24.13 69.09,24.13 70.73,25.52 Q1.3 | C2.+ 64.58,18.76 | JP2.1 64.46,6.34 64.4,6.28 64.4,6.2 64.52,6.57 64.52,18.54 64.49,18.83 C2.+ | 67.06,24.13 v67.06,25.4
  Top 0.7: 64.63,6.21 65.8,6.21 67.2,4.8 68.85,4.8
  Bottom 0.61: JP1.1 JP2.1 | v67.06,25.4 66.04,26.92 SJ13.3
VCC
  Top 0.203: FB1.2 23.47,52.9 23.27,53.15 | 23.27,53.15 20.62,53.15 | C17.1 23.27,50.34 23.27,53.15
  Top 0.305: U5.8 20.62,53.15 19.96,52.5 18.28,52.5 R17.1
VIN  (via drill 0.3, 0.6)
  Top 0.152: R1.2 v59.69,36.07 | v71.63,32.26 72.9,32.26
  Top 0.203: U2.3 71.37,37.85 72.39,37.85 v72.91,36.1
  Top 0.584: 88.45,53.59 J13.1
  Top 0.61: S1.COM1 83.8,56.67 86.87,53.59 88.45,53.59 | U7.1 70.19,29.59 72.01,29.59 72.9,30.48 72.9,32.26 72.9,35.81 v72.91,36.1 72.59,36.03 U2.1
  Bottom 0.152: v59.69,36.07 69.34,36.07 70.87,34.54 70.87,33.02 v71.63,32.26
  Bottom 0.584: v72.91,36.1 73.57,37.12 82.87,37.18 83.51,38.02 86.6,41.48 86.6,52.24 87.9,53.54 J13.1
VUSB  (via drill 0.3, 0.6)
  Top 0.406: J2.4 82.14,12.49
  Top 0.508: USB1.1 88.86,42.95 arc90 87.45,41.79
  Top 0.61: J2.4 82.04,12.63 | 86.87,23.37 v85.58,24.84 R6.2 D3.+ Q1.1
  Top 0.7: 82.14,12.49 82.14,10.64 81.69,10.1 D1.+ | 82.04,12.63 82.04,13.97 86.85,17.77 86.85,18.92 86.87,18.8 86.87,23.37 | 87.45,41.79 87.45,37.87 84.82,35.4 v84.82,30.75
  Bottom 0.178: 82.3,30.73 v84.82,30.75
  Bottom 0.203: SJ11.2 82.3,30.73
  Bottom 0.7: v84.82,30.75 84.84,30.48 84.84,25.91 85.55,24.84 v85.58,24.84

### Text on the board
tPlace: ver 0.5b | D21 Button | SPI/ / SD card | OFF | ON | AA2 AA3 V Gnd | AA0 AA1 V Gnd | Remote / Switch | ICSP | J10 | 5V | 3.3V | Aux Analog | switched | D10-11 | 3.3V | 5V | switched | D10 D11 V Gnd | D6-7 | Mayfly Data Logger | Stroud EnviroDIY | 3.3V | 5V | switched | D6 D7 V Gnd | D4-5 | Ext USB/LiPo | J11 | 3.3V | D4 D5 V Gnd | switched | I2C | 3.3V | Reset | - + | Ext 4-12v | GND / GND / USB5V / RXD / TXD / DTR | BLK | FTDI / Programming | SCL SDA V Gnd | SOLAR | + | + | - | - | BATT | SOLAR | LIPO | - | +
bPlace: USB Prog
tNames: Sw3 | AA2 | AA0 | RX1 | RX0 | 3V3 | A7 | A4 | A2 | A0 | Sw5 | AREF | AA3 | AA1 | TX1 | TX0 | A5 | A3 | A1 | GND | J8 | J7 | J6 | L1 | J5 | Sw3 | D12 | SDA | D20 | D18 | D10 | 3V3 | D8 | D6 | D4 | Sw5 | D23 | SCL | D21 | D19 | D11 | D9 | D7 | D5 | GND
bNames: S/N: | LED3 | Stroud Water Research Center / EnviroDIY.org | Mayfly Data Logger v0.5b | Remote / Switch | Stroud EnviroDIY | RXD1 | D10 D11 V GND | RXD_BEE | J16 | D10 P/U | RXD0 | TXD0 | TXD_BEE | TXD1 | 3v3 | BEE_Vcc | D21-Button | LIPO | D4 D5 V GND | D10 | J15 | SQW/INT | A7 | ASSOC | A5 | 32kHz | RI | D18 | RST | - + | Ext 4-12v | D18 / C/D | LED4